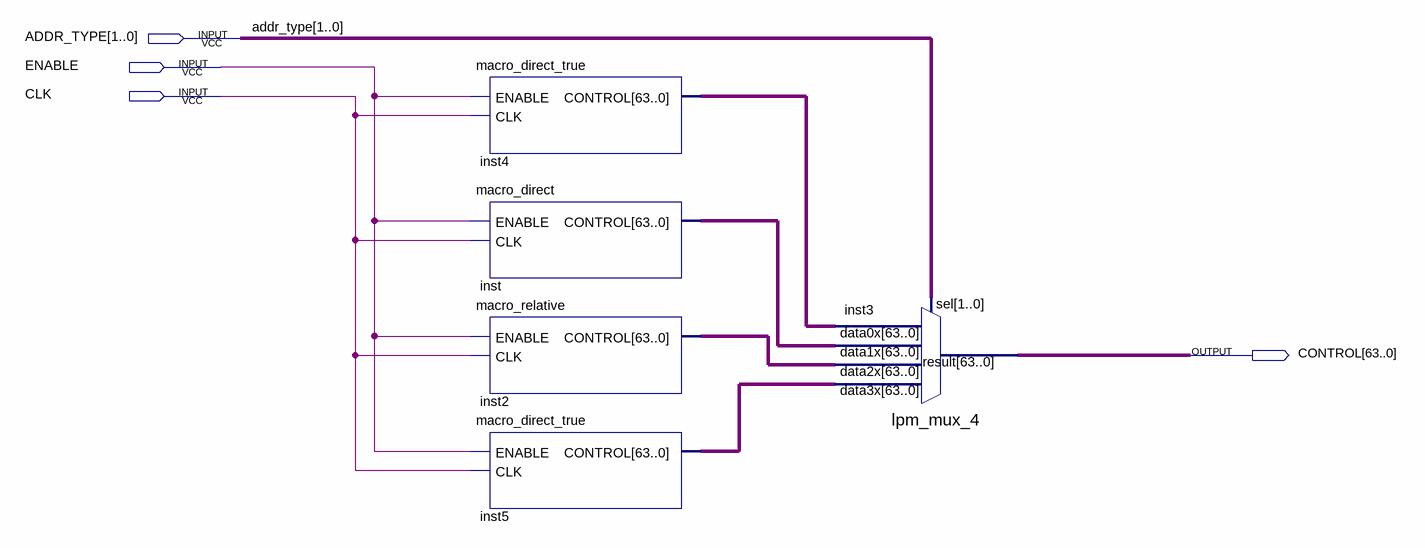
[diagram p0: schematic sheet]
// Quartus schematic macro_load_op.bdf as structural Verilog: 5 symbols, 4 pins
module macro_load_op (
  input  [1:0] ADDR_TYPE,
  input  ENABLE,
  input  CLK,
  output [63:0] CONTROL
);

  wire [63:0] inst2_control, inst4_control, inst5_control, inst_control;

  macro_direct_true inst4 (.ENABLE(ENABLE), .CLK(CLK), .CONTROL(inst4_control));
  macro_direct inst (.ENABLE(ENABLE), .CLK(CLK), .CONTROL(inst_control));
  macro_relative inst2 (.ENABLE(ENABLE), .CLK(CLK), .CONTROL(inst2_control));
  macro_direct_true inst5 (.ENABLE(ENABLE), .CLK(CLK), .CONTROL(inst5_control));
  lpm_mux_4 inst3 (
    .data3x(inst5_control), .data2x(inst2_control), .data1x(inst_control), .data0x(inst4_control),
    .sel(ADDR_TYPE), .result(CONTROL));
endmodule
